# EAGLE design programming adaptor (EAGLE 9.4.0)
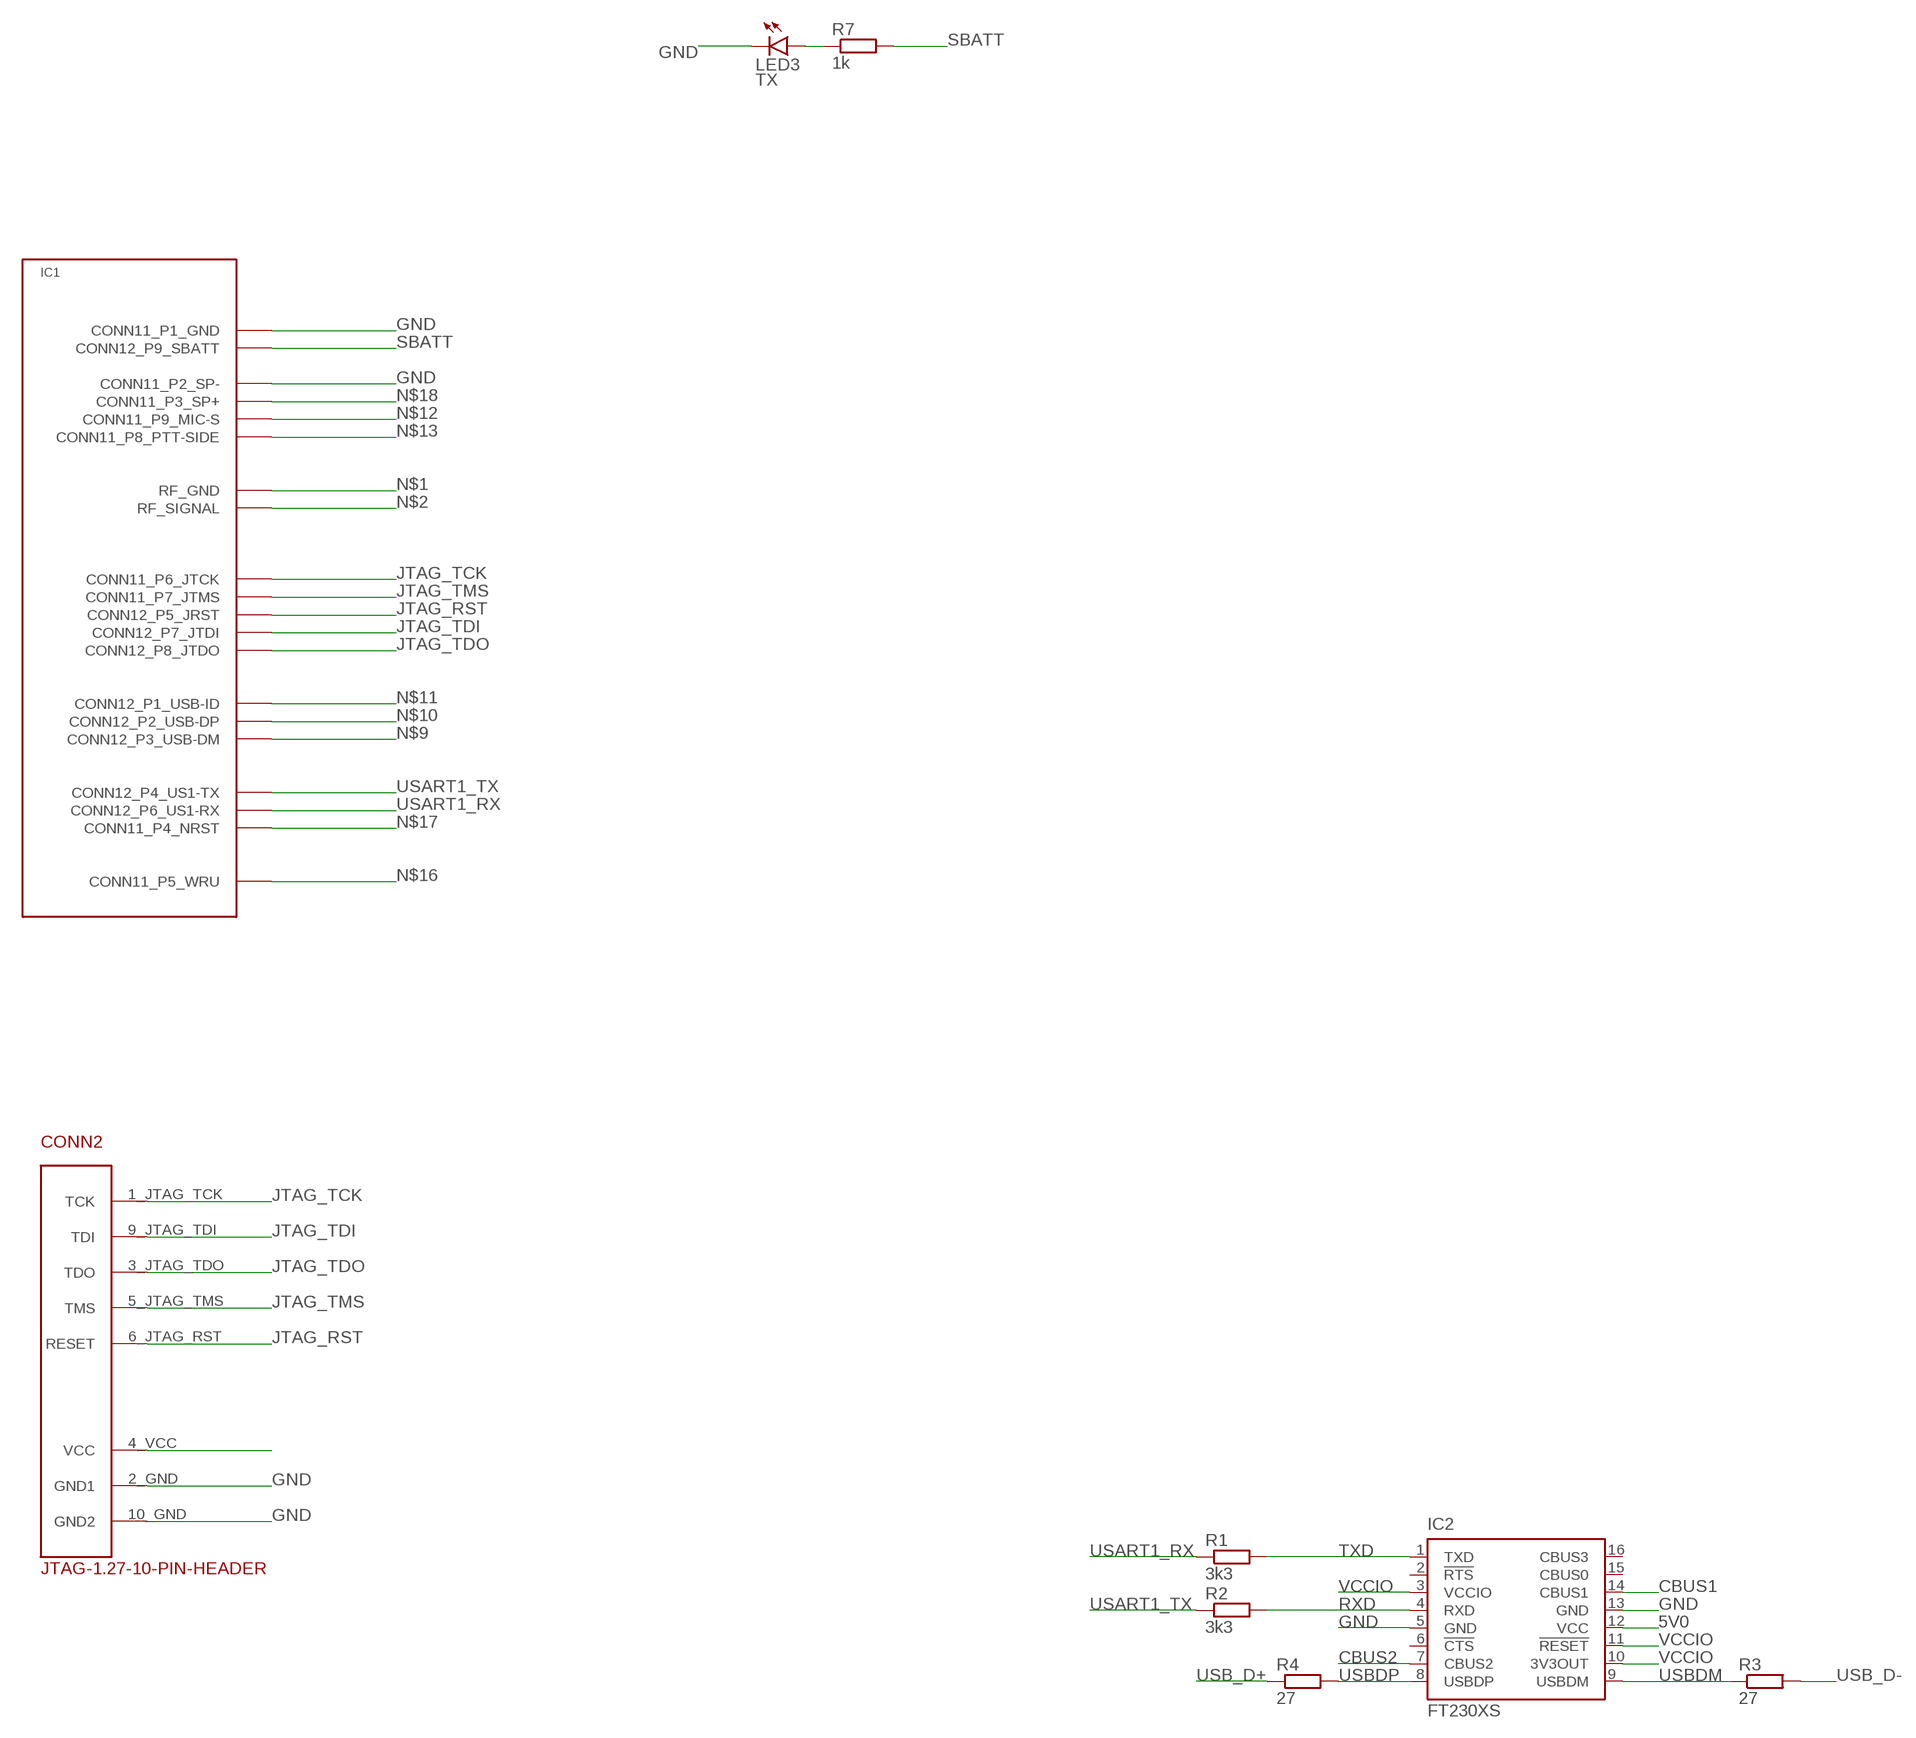
[diagram p0: schematic, sheet 1, part 1 of 2]
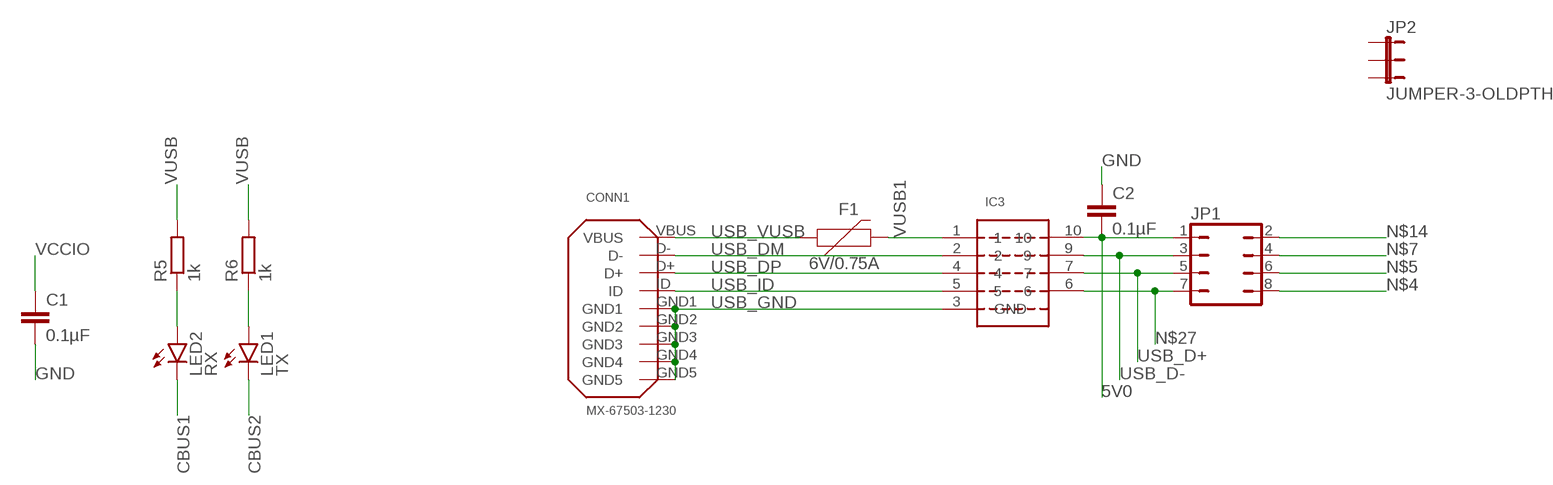
[diagram p1: schematic, sheet 1, part 2 of 2]

## Parts
C1  0.1µF  C-EUC0805  [C0805]
C2  0.1µF  C-EUC0805  [C0805]
CONN1  MX-67503-1230  [SMT]
CONN2  JTAG-1.27-10-PIN-HEADER  [TH-JTAG]
F1  6V/0.75A  PPTC_THREE-QUARTER-AMP  [1206]
IC1  FLC-148  [TH]
IC2  FT230XS  [SSOP16]
IC3  SP3012-04UTG  [μDFN-10]
JP1  JP4Q  [JP4Q]
JP2  JUMPER-3-OLDPTH  [1X03]
LED1  TX  LEDCHIPLED_1206  [CHIPLED_1206]
LED2  RX  LEDCHIPLED_1206  [CHIPLED_1206]
LED3  TX  LEDCHIPLED_1206  [CHIPLED_1206]
R1  3k3  R-EU_R0805  [R0805]
R2  3k3  R-EU_R0805  [R0805]
R3  27  R-EU_R0805  [R0805]
R4  27  R-EU_R0805  [R0805]
R5  1k  R-EU_R0805  [R0805]
R6  1k  R-EU_R0805  [R0805]
R7  1k  R-EU_R0805  [R0805]

## Nets
5V0: C2.2 IC2.12(VCC) IC3.10 JP1.1
CBUS1: IC2.14(CBUS1) LED2.C
CBUS2: IC2.7(CBUS2) LED1.C
GND: C1.2 C2.1 CONN2.2_GND(GND1) CONN2.10_GND(GND2) IC1.CONN11_P1(CONN11_P1_GND) IC1.CONN11_P2(CONN11_P2_SP-) IC2.5(GND) IC2.13(GND) LED3.C
JTAG_RST: CONN2.6_JTAG_RST(RESET) IC1.CONN12_P5(CONN12_P5_JRST)
JTAG_TCK: CONN2.1_JTAG_TCK(TCK) IC1.CONN11_P6(CONN11_P6_JTCK)
JTAG_TDI: CONN2.9_JTAG_TDI(TDI) IC1.CONN12_P7(CONN12_P7_JTDI)
JTAG_TDO: CONN2.3_JTAG_TDO(TDO) IC1.CONN12_P8(CONN12_P8_JTDO)
JTAG_TMS: CONN2.5_JTAG_TMS(TMS) IC1.CONN11_P7(CONN11_P7_JTMS)
N$1: IC1.RF_GND
N$2: IC1.RF_SIGNAL
N$4: JP1.8
N$5: JP1.6
N$6: LED2.A R5.1
N$7: JP1.4
N$8: LED1.A R6.1
N$9: IC1.CONN12_P3(CONN12_P3_USB-DM)
N$10: IC1.CONN12_P2(CONN12_P2_USB-DP)
N$11: IC1.CONN12_P1(CONN12_P1_USB-ID)
N$12: IC1.CONN11_P9(CONN11_P9_MIC-S)
N$13: IC1.CONN11_P8(CONN11_P8_PTT-SIDE)
N$14: JP1.2
N$15: LED3.A R7.1
N$16: IC1.CONN11_P5(CONN11_P5_WRU)
N$17: IC1.CONN11_P4(CONN11_P4_NRST)
N$18: IC1.CONN11_P3(CONN11_P3_SP+)
N$24: CONN2.4_VCC(VCC)
N$27: IC3.6 JP1.7
RXD: IC2.4(RXD) R2.2
SBATT: IC1.CONN12_P9(CONN12_P9_SBATT) R7.2
TXD: IC2.1(TXD) R1.2
USART1_RX: IC1.CONN12_P6(CONN12_P6_US1-RX) R1.1
USART1_TX: IC1.CONN12_P4(CONN12_P4_US1-TX) R2.1
USB_D+: IC3.7 JP1.5 R4.1
USB_D-: IC3.9 JP1.3 R3.2
USB_DM: CONN1.D- IC3.2
USB_DP: CONN1.D+ IC3.4
USB_GND: CONN1.GND1 CONN1.GND2 CONN1.GND3 CONN1.GND4 CONN1.GND5 IC3.3(GND)
USB_ID: CONN1.ID IC3.5
USB_VUSB: CONN1.VBUS F1.1
USBDM: IC2.9(USBDM) R3.1
USBDP: IC2.8(USBDP) R4.2
VCCIO: C1.1 IC2.3(VCCIO) IC2.10(3V3OUT) IC2.11(!RESET)
VUSB: R5.2 R6.2
VUSB1: F1.2 IC3.1
Unconnected: IC2.2(!RTS) IC2.6(!CTS) IC2.15(CBUS0) IC2.16(CBUS3) JP2.1 JP2.2 JP2.3

## Library data of the parts
C1 C2 = rcl:C-EU: CAPACITOR, European symbol; SPICEPREFIX: C
CONN1 = MX-67503-1230 USB Mini-B SMT straight socket:MX-67503-1230
CONN2 = JTAG 1.27mm 10pin header:JTAG-1.27-10-PIN-HEADER
F1 = SparkFun-Fuses:PPTC: Resettable Fuse PPTC Resettable Fuse. Really a sort of resistor with a polymeric positive temperature coefficient whose resistance increases dramatically with an increase in temperature. When heated by the power passing through the resistance rises causing the current to be limited, protecting the circuit. This is achieved by the transition of the polymer from a crystalline to an amorphous state where the conductive carbon separates breaking the conductive pathways found in the cool crystalline structure. When a PPTC cools back down it resumes conducting letting the circuit turn back on. SparkFun Products: SparkFun RedBoard - Programmed with Arduino <https://www.sparkfun.com/products/12757> Pro Micro - 5V/16MHz <https://www.sparkfun.com/products/12640> Arduino Pro 328 - 5V/16MHz <https://www.sparkfun.com/products/10915> MP3 Trigger <https://www.sparkfun.com/products/13720>; PROD_ID: RES-11150
IC1 = programming adaptor:FLC-148
IC2 = ftdichip:FT230X: USB to BASIC UART IC Auto generated by make-symbol-device-package-bsdl.ulp Rev. 43 Source: Data sheet <http://www.ftdichip.com/Support/Documents/DataSheets/ICs/DS_FT230X.pdf>
IC3 = SP3012 TVS Diode Array:SP3012-04UTG
JP1 = jumper:JP4Q: JUMPER
JP2 = SparkFun-Retired:JUMPER-3-OLD
LED1-LED3 = led:LED: LED OSRAM: - CHIPLED LG R971, LG N971, LY N971, LG Q971, LY Q971, LO R971, LY R971 LH N974, LH R974 LS Q976, LO Q976, LY Q976 LO Q996 - Hyper CHIPLED LW Q18S LB Q993, LB Q99A, LB R99A - SideLED LS A670, LO A670, LY A670, LG A670, LP A670 LB A673, LV A673, LT A673, LW A673 LH A674 LY A675 LS A676, LA A676, LO A676, LY A676, LW A676 LS A679, LY A679, LG A679 - Hyper Micro SIDELED® LS Y876, LA Y876, LO Y876, LY Y876 LT Y87S - SmartLED LW L88C, LW L88S LB L89C, LB L89S, LG L890 LS L89K, LO L89K, LY L89K LS L896, LA L896, LO L896, LY L896 - TOPLED LS T670, LO T670, LY T670, LG T670, LP T670 LSG T670, LSP T670, LSY T670, LOP T670, LYG T670 LG T671, LOG T671, LSG T671 LB T673, LV T673, LT T673, LW T673 LH T674 LS T676, LA T676, LO T676, LY T676, LB T676, LH T676, LSB T676, LW T676 LB T67C, LV T67C, LT T67C, LS T67K, LO T67K, LY T67K, LW E67C LS E67B, LA E67B, LO E67B, LY E67B, LB E67C, LV E67C, LT E67C LW T67C LS T679, LY T679, LG T679 LS T770, LO T770, LY T770, LG T770, LP T770 LB T773, LV T773, LT T773, LW T773 LH T774 LS E675, LA E675, LY E675, LS T675 LS T776, LA T776, LO T776, LY T776, LB T776 LHGB T686 LT T68C, LB T68C - Hyper Mini TOPLED® LB M676 - Mini TOPLED Santana® LG M470 LS M47K, LO M47K, LY M47K Source: http://www.osram.convergy.de LUXEON: - LUMILED® LXK2-PW12-R00, LXK2-PW12-S00, LXK2-PW14-U00, LXK2-PW14-V00 LXK2-PM12-R00, LXK2-PM12-S00, LXK2-PM14-U00 LXK2-PE12-Q00, LXK2-PE12-R00, LXK2-PE12-S00, LXK2-PE14-T00, LXK2-PE14-U00 LXK2-PB12-K00, LXK2-PB12-L00, LXK2-PB12-M00, LXK2-PB14-N00, LXK2-PB14-P00, LXK2-PB14-Q00 LXK2-PR12-L00, LXK2-PR12-M00, LXK2-PR14-Q00, LXK2-PR14-R00 LXK2-PD12-Q00, LXK2-PD12-R00, LXK2-PD12-S00 LXK2-PH12-R00, LXK2-PH12-S00 LXK2-PL12-P00, LXK2-PL12-Q00, LXK2-PL12-R00 Source: www.luxeon.com KINGBRIGHT: KA-3528ASYC Source: www.kingbright.com
R1-R7 = rcl:R-EU_: RESISTOR, European symbol; SPICEPREFIX: R

## Board
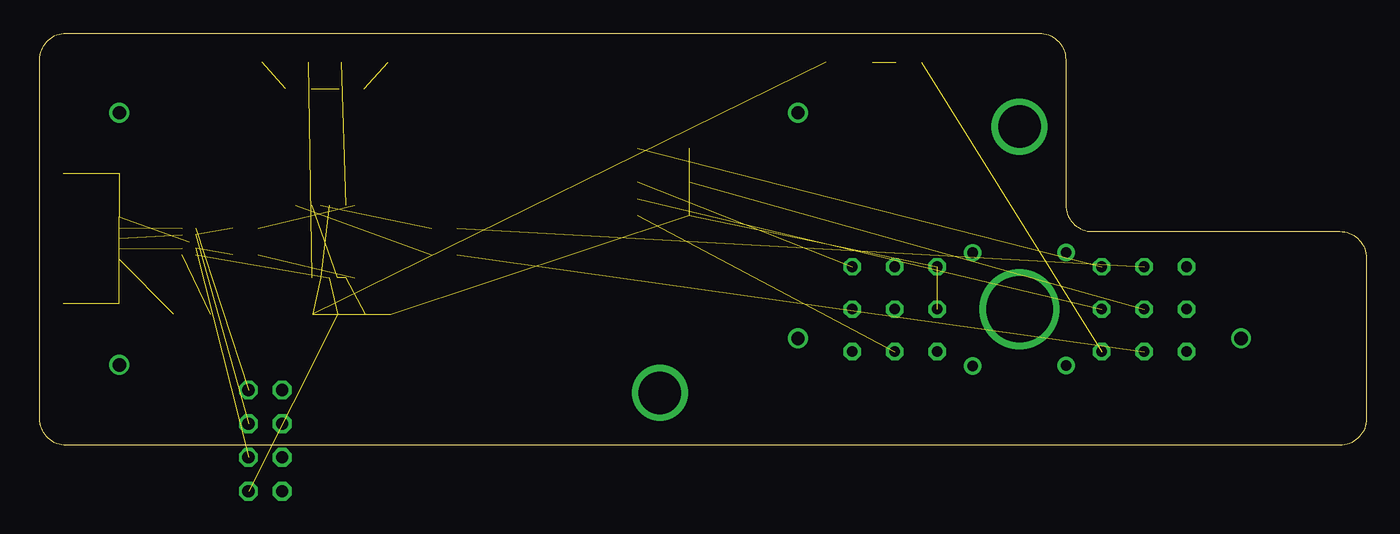
[diagram p2: board, top side]
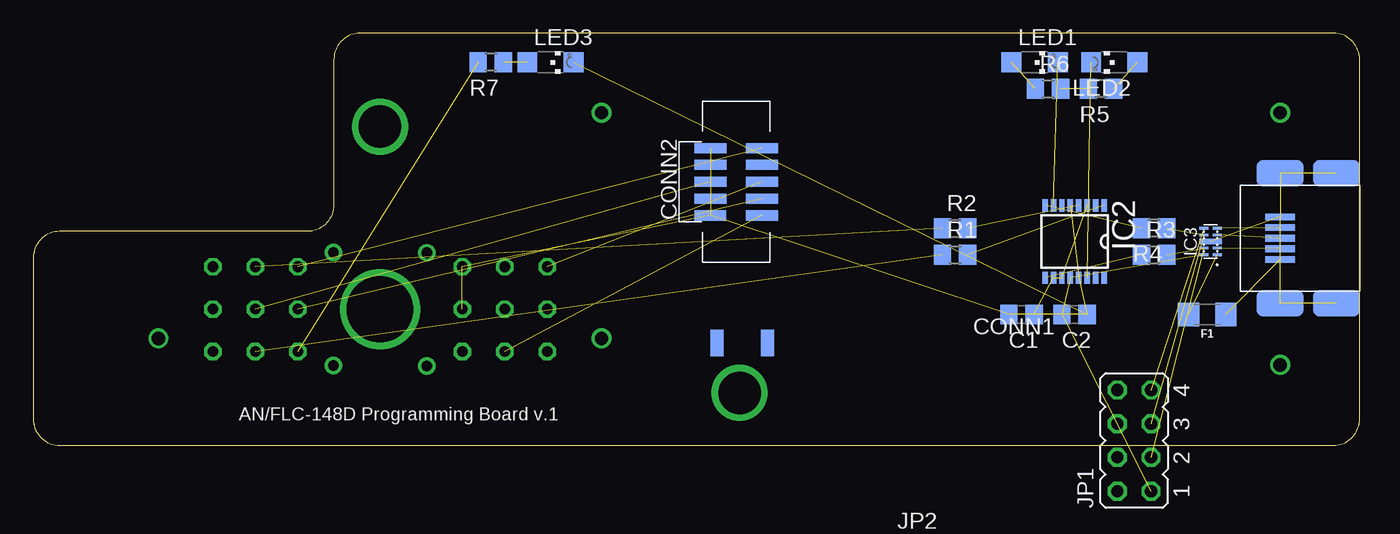
[diagram p3: board, bottom side, seen from below]

Size 100 x 31.06 mm. Coordinates in mm from the lower left corner, seen from the top.
Outline: 0,29.06 arc-90 2,31.06 75.34,31.06 arc-90 77.34,29.06 77.34,18.12 arc90 79.34,16.12 98,16.12 arc-90 100,14.12 100,2 arc-90 98,0 2,0 arc-90 0,2 0,29.06
Copper layers (1*16): Top 0.035mm / dielectric 1.5mm / Bottom 0.035mm
Design rules "default": minimum track width 6mil, minimum drill 0.35mm, track to track 6mil, track to pad 6mil, pad to pad 6mil, via to via 6mil, smd to smd 6mil, copper to edge 40mil, drill to drill 6mil, minimum pad ring 10mil, minimum via ring 8mil, stop-mask expansion 4mil, vias tented up to drill 0mil, thermal gap 10mil

### Footprints (pad centres in the part's own frame; a part is rotated, then mirrored left to right if it is on the bottom)
C0805 = smd 1.3 x 1.5: 1 -0.95,0; 2 0.95,0
SMT = smd 2.25 x 0.5: D+ 0,0; D- 0,0.8; GND1 0,-1.6; ID 0,-0.8; VBUS 0,1.6 | smd 3.5 x 2: GND2 -4.25,-4.9; GND3 0,-4.9; GND4 0,4.9; GND5 -4.25,4.9
TH-JTAG = smd 0.76 x 2.4: 1_JTAG_TCK -2.54,-1.94; 2_GND -2.54,1.955; 3_JTAG_TDO -1.27,-1.95; 4_VCC -1.27,1.95; 5_JTAG_TMS 0,-1.95; 6_JTAG_RST 0,1.95; 7_NC 1.27,-1.95; 8_NC 1.27,1.95; 9_JTAG_TDI 2.54,-1.95; 10_GND 2.54,1.95
1206 = smd 1.6 x 1.8: 1 -1.4,0; 2 1.4,0
TH = drill 0.8 octagon: CONN11_P1 6.2,3.2; CONN11_P2 6.2,0; CONN11_P3 6.2,-3.2; CONN11_P4 9.4,3.2; CONN11_P5 9.4,0; CONN11_P6 9.4,-3.2; CONN11_P7 12.6,3.2; CONN11_P8 12.6,0; CONN11_P9 12.6,-3.2; CONN12_P1 -12.6,3.2; CONN12_P2 -12.6,0; CONN12_P3 -12.6,-3.2; CONN12_P4 -9.4,3.2; CONN12_P5 -9.4,0; CONN12_P6 -9.4,-3.2; CONN12_P7 -6.2,3.2; CONN12_P8 -6.2,0; CONN12_P9 -6.2,-3.2 | drill 5: GND0 0,0 | drill 3.2: GND1 0,13.75; RF 27.1,-6.3 | drill 0.8: GND2 -3.525,4.275; GND3 3.525,4.25; GND4 3.525,-4.275; GND5 -3.525,-4.25 | smd 1 x 2: RF_GND 29.21,-2.54; RF_SIGNAL 25.4,-2.54
SSOP16 = smd 0.914 x 0.406: 1 -2.718,2.223; 2 -2.718,1.587; 3 -2.718,0.953; 4 -2.718,0.318; 5 -2.718,-0.318; 6 -2.718,-0.953; 7 -2.718,-1.587; 8 -2.718,-2.223; 9 2.718,-2.223; 10 2.718,-1.587; 11 2.718,-0.953; 12 2.718,-0.318; 13 2.718,0.318; 14 2.718,0.953; 15 2.718,1.587; 16 2.718,2.223
μDFN-10 = smd 0.2 x 0.675: 1 -1,-0.5; 2 -0.5,-0.5; 4 0.5,-0.5; 5 1,-0.5; 6 1,0.5; 7 0.5,0.5; 9 -0.5,0.5; 10 -1,0.5 | smd 0.4 x 1.7: 3 0,0
JP4Q = drill 0.914 octagon: 1 -3.81,-1.27; 2 -3.81,1.27; 3 -1.27,-1.27; 4 -1.27,1.27; 5 1.27,-1.27; 6 1.27,1.27; 7 3.81,-1.27; 8 3.81,1.27
1X03 = drill 1.016 pad 1.88: 1 0,0; 2 2.54,0; 3 5.08,0
CHIPLED_1206 = smd 1.5 x 1.5: A 0,-1.75; C 0,1.75
R0805 = smd 1.3 x 1.5: 1 -0.95,0; 2 0.95,0

### Placement (x,y rotation side)
C1  25.5,9.86 180 bottom
C2  21.5,9.86 180 bottom
CONN1  6,15.61 180 bottom
CONN2  47,19.86 90 bottom
F1  11.5,9.86 180 bottom
IC1  73.85,10.26 0 bottom
IC2  21.5,15.36 270 bottom
IC3  11.25,15.36 90 bottom
JP1  17,0.36 90 bottom
JP2  35,-9.14 0 bottom  (outside the outline)
LED1  24.5,28.86 270 bottom
LED2  18.5,28.86 90 bottom
LED3  61,28.86 270 bottom
R1  30.5,14.36 0 bottom
R2  30.5,16.36 0 bottom
R3  15.5,14.36 0 bottom
R4  15.5,16.36 180 bottom
R5  19.5,26.86 180 bottom
R6  23.5,26.86 0 bottom
R7  65.5,28.86 180 bottom

### Tracks (layer width: path | path; a pad name or v marks a point on that pad's centre or on a via)
5V0  (3 unrouted)
CBUS1  (1 unrouted)
CBUS2  (1 unrouted)
GND  (8 unrouted)
JTAG_RST  (1 unrouted)
JTAG_TCK  (1 unrouted)
JTAG_TDI  (1 unrouted)
JTAG_TDO  (1 unrouted)
JTAG_TMS  (1 unrouted)
N$6  (1 unrouted)
N$8  (1 unrouted)
N$15  (1 unrouted)
N$27  (1 unrouted)
RXD  (1 unrouted)
S$1  (via drill 1)
  other vias: 6,25.06
S$2  (via drill 1)
  other vias: 6,6.06
S$3  (via drill 1)
  other vias: 57.15,8.06
S$4  (via drill 1)
  other vias: 57.15,25.06
S$5  (via drill 1)
  other vias: 90.55,8.06
SBATT  (1 unrouted)
TXD  (1 unrouted)
USART1_RX  (1 unrouted)
USART1_TX  (1 unrouted)
USB_D+  (2 unrouted)
USB_D-  (2 unrouted)
USB_DM  (1 unrouted)
USB_DP  (1 unrouted)
USB_GND  (5 unrouted)
USB_ID  (1 unrouted)
USB_VUSB  (1 unrouted)
USBDM  (1 unrouted)
USBDP  (1 unrouted)
VCCIO  (3 unrouted)
VUSB  (1 unrouted)
VUSB1  (1 unrouted)

### Text on the board
bNames: AN/FLC-148D Programming Board v.1
Reference: TOP | ANT | BAT | BOTTOM